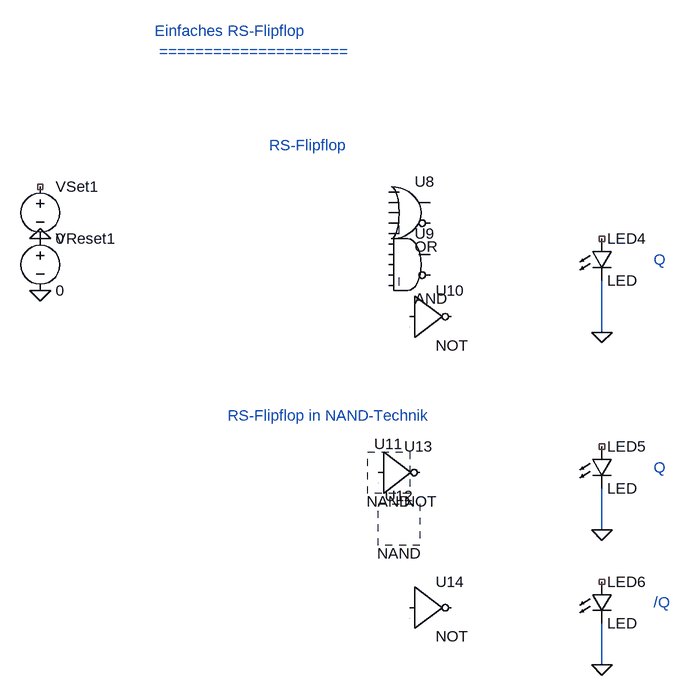
[diagram p0: schematic 6_1_1_Einfaches_RS_Flipflop.asc]
6_1_1_Einfaches_RS_Flipflop.asc, the LTspice schematic file:
Version 4
SHEET 1 880 680
WIRE 1120 432 1120 464
WIRE 1120 752 1120 784
WIRE 1120 960 1120 992
WIRE 1120 512 1120 464
WIRE 1120 816 1120 784
WIRE 1120 1024 1120 992
FLAG 256 368 0
FLAG 256 448 0
FLAG 1120 512 0
FLAG 1120 816 0
FLAG 1120 1024 0
FLAG 1120 512 0
FLAG 1120 816 0
FLAG 1120 1024 0
SYMBOL Digital\or 824 264 R0
SYMATTR InstName U8
SYMATTR Value OR
SYMATTR LibreSpice gate=or;inputs=2;vth=2.5;vhigh=5;pins=In1,In2,Out
SYMBOL Digital\and 824 344 R0
SYMATTR InstName U9
SYMATTR Value AND
SYMATTR LibreSpice gate=and;inputs=2;vth=2.5;vhigh=5;pins=In1,In2,Out
SYMBOL Digital\inv 824 424 R0
SYMATTR InstName U10
SYMATTR Value NOT
SYMATTR LibreSpice gate=not;inputs=1;vth=2.5;vhigh=5;pins=In1,Out
SYMBOL voltage 256 272 R0
SYMATTR InstName VSet1
SYMATTR Value 0
SYMBOL voltage 256 352 R0
SYMATTR InstName VReset1
SYMATTR Value 0
SYMBOL LED 1104 368 R0
SYMATTR InstName LED4
SYMATTR Value LED
SYMBOL Digital\nand 792 728 R0
SYMATTR InstName U11
SYMATTR Value NAND
SYMATTR LibreSpice gate=nand;inputs=2;vth=2.5;vhigh=5;pins=In1,In2,Out
SYMBOL Digital\nand 808 808 R0
SYMATTR InstName U12
SYMATTR Value NAND
SYMATTR LibreSpice gate=nand;inputs=2;vth=2.5;vhigh=5;pins=In1,In2,Out
SYMBOL Digital\inv 776 664 R0
SYMATTR InstName U13
SYMATTR Value NOT
SYMATTR LibreSpice gate=not;inputs=1;vth=2.5;vhigh=5;pins=In1,Out
SYMBOL Digital\inv 824 872 R0
SYMATTR InstName U14
SYMATTR Value NOT
SYMATTR LibreSpice gate=not;inputs=1;vth=2.5;vhigh=5;pins=In1,Out
SYMBOL LED 1104 688 R0
SYMATTR InstName LED5
SYMATTR Value LED
SYMBOL LED 1104 896 R0
SYMATTR InstName LED6
SYMATTR Value LED
TEXT 432 48 Left 2 ;Einfaches RS-Flipflop \n =====================
TEXT 608 224 Left 2 ;RS-Flipflop
TEXT 544 640 Left 2 ;RS-Flipflop in NAND-Technik
TEXT 1200 400 Left 2 ;Q
TEXT 1200 720 Left 2 ;Q
TEXT 1200 928 Left 2 ;/Q

The netlist it stands for:
* 6_1_1_Einfaches_RS_Flipflop.asc
A§U8 0 0 0 0 0 0 0 0 OR OR
A§U9 0 0 0 0 0 0 0 0 AND AND
A§U10 0 0 0 0 0 0 0 0 BUF NOT
VSet1 NC_01 0 0
VReset1 0 0 0
D§LED4 NC_02 0 LED
* U11: NAND (symbol Digital\nand not available, pin order unknown); nets seen at it: 
* U12: NAND (symbol Digital\nand not available, pin order unknown); nets seen at it: 
A§U13 0 0 0 0 0 0 0 0 BUF NOT
A§U14 0 0 0 0 0 0 0 0 BUF NOT
D§LED5 NC_03 0 LED
D§LED6 NC_04 0 LED
.model D D
.lib standard.dio
* Einfaches RS-Flipflop
*  =====================
* RS-Flipflop
* RS-Flipflop in NAND-Technik
* Q
* Q
* /Q
.backanno
.end